# EAGLE design board (EAGLE 9.4.2)

## Sheet 1 of 2
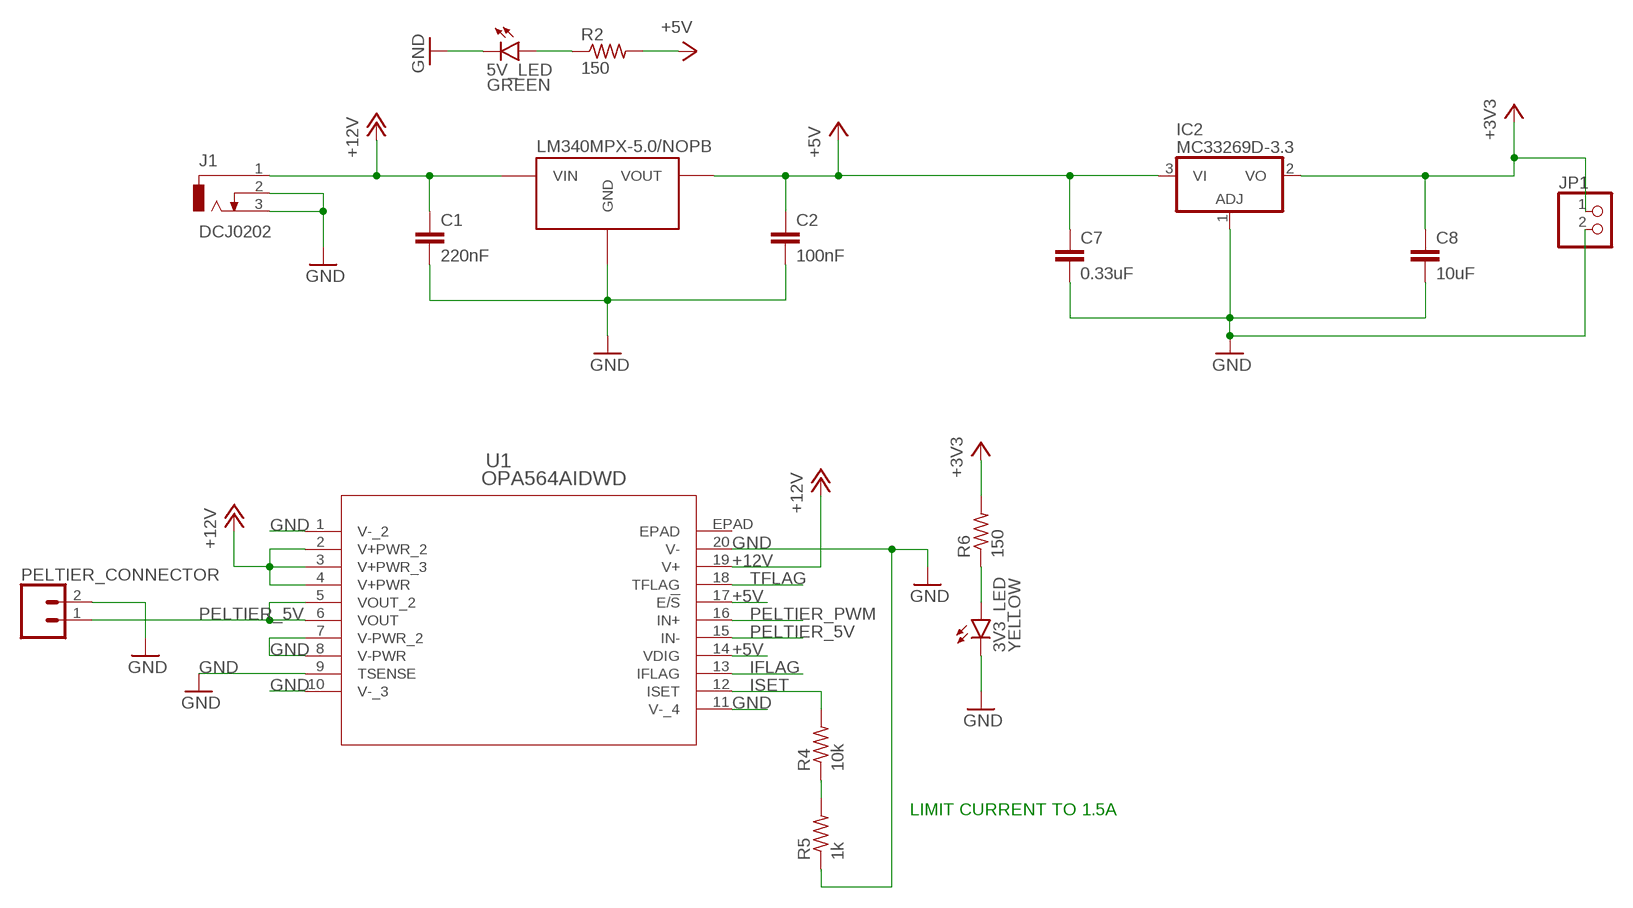
[diagram p0: schematic, sheet 1]

### Parts
3V3_LED  YELLOW  LEDCHIP-LED0603  [CHIP-LED0603]
5V_LED  GREEN  LEDCHIP-LED0603  [CHIP-LED0603]
C1  220nF  C-EUC0805  [C0805]
C2  100nF  C-EUC0805  [C0805]
C7  0.33uF  C-EUC0805  [C0805]
C8  10uF  C-EUC0805  [C0805]
IC2  MC33269D-3.3  [DPACK]
J1  DCJ0202  [DCJ0202]
JP1  PINHD-1X2  [1X02]
LDO1  LM340MPX-5.0/NOPB  [SOT-223]
PELTIER_CONNECTOR  CONN_025MM  [SCREWTERMINAL-5MM-2]
R2  150  R-US_R0603  [R0603]
R4  10k  R-US_R0603  [R0603]
R5  1k  R-US_R0603  [R0603]
R6  150  R-US_R0603  [R0603]
U1  OPA564AIDWD  [DWD20_4P62X3P56]

### Nets
+3V3: C8.1 IC2.2(VO) JP1.1 R6.2
+5V: C2.1 C7.1 IC2.3(VI) LDO1.P$3(VOUT) R2.2 U1.14(VDIG) U1.17(E/!S) ; also sheet 2
+12V: C1.1 J1.1 LDO1.P$1(VIN) U1.2(V+PWR_2) U1.3(V+PWR_3) U1.4(V+PWR) U1.19(V+) ; also sheet 2
GND: 3V3_LED.C 5V_LED.C C1.2 C2.2 C7.2 C8.2 IC2.1(ADJ) J1.2 J1.3 JP1.2 LDO1.P$2(GND) LDO1.P$4(GND) PELTIER_CONNECTOR.2 R5.1 U1.1(V-_2) U1.7(V-PWR_2) U1.8(V-PWR) U1.9(TSENSE) U1.10(V-_3) U1.11(V-_4) U1.20(V-) ; also sheet 2
IFLAG: U1.13(IFLAG) ; also sheet 2
ISET: R4.2 U1.12(ISET)
N$5: 5V_LED.A R2.1
N$21: R4.1 R5.2
N$37: 3V3_LED.A R6.1
PELTIER_5V: PELTIER_CONNECTOR.1 U1.5(VOUT_2) U1.6(VOUT) U1.15(IN-)
PELTIER_PWM: U1.16(IN+) ; also sheet 2
TFLAG: U1.18(TFLAG) ; also sheet 2
Unconnected: U1.EPAD

### Notes on the sheet
- LIMIT CURRENT TO 1.5A

## Sheet 2 of 2
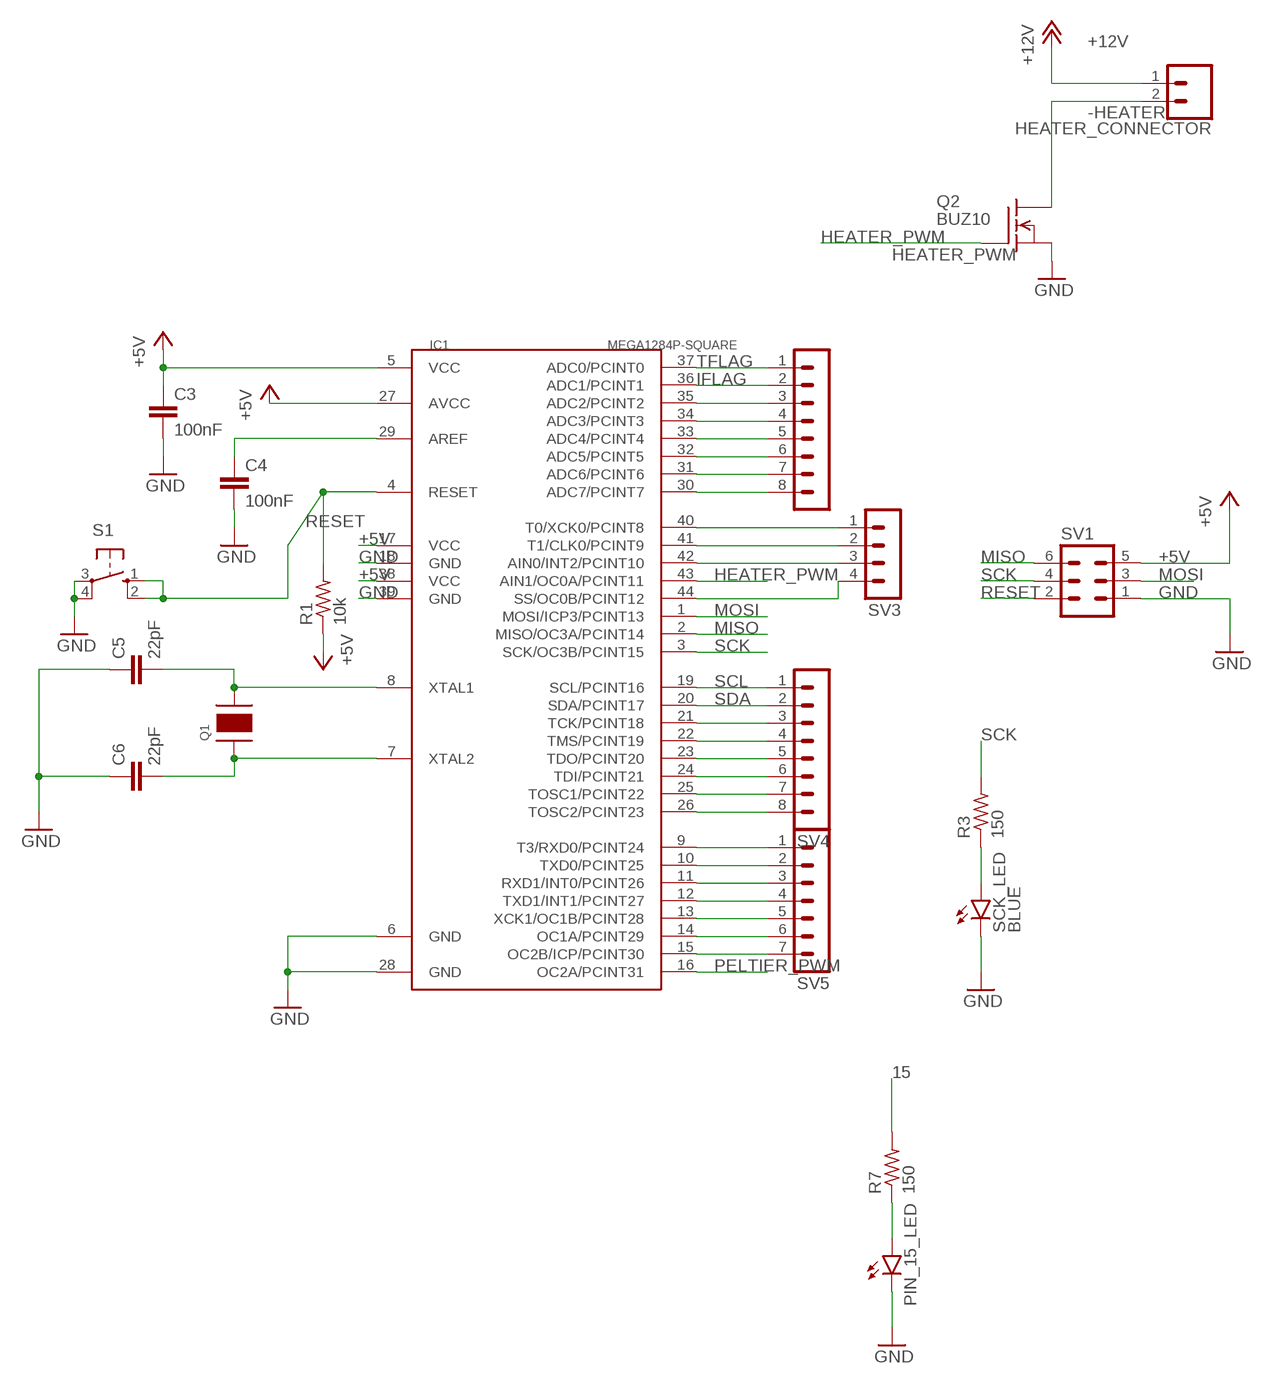
[diagram p1: schematic, sheet 2]

### Parts
C3  100nF  C-EUC0603  [C0603]
C4  100nF  C-EUC0603  [C0603]
C5  22pF  C-EUC0603  [C0603]
C6  22pF  C-EUC0603  [C0603]
HEATER_CONNECTOR  CONN_025MM  [SCREWTERMINAL-5MM-2]
IC1  MEGA1284P-SQUARE  [TQFP44]
PIN_15_LED  BLUE  LEDCHIP-LED0603  [CHIP-LED0603]
Q1  CRYSTAL_16MHZ_SMD  [4-SMD_DFN]
Q2  BUZ10  [TO220]
R1  10k  R-US_R0603  [R0603]
R3  150  R-US_R0603  [R0603]
R7  150  R-US_R0603  [R0603]
S1  10-XX  [B3F-10XX]
SCK_LED  BLUE  LEDCHIP-LED0603  [CHIP-LED0603]
SV1  MA03-2  [MA03-2]
SV2  MA08-1  [MA08-1]
SV3  MA04-1  [MA04-1]
SV4  MA08-1  [MA08-1]
SV5  MA07-1  [MA07-1]

### Nets
9: IC1.9(T3/RXD0/PCINT24) SV5.1
10: IC1.10(TXD0/PCINT25) SV5.2
11: IC1.11(RXD1/INT0/PCINT26) SV5.3
12: IC1.12(TXD1/INT1/PCINT27) SV5.4
13: IC1.13(XCK1/OC1B/PCINT28) SV5.5
14: IC1.14(OC1A/PCINT29) SV5.6
15: IC1.15(OC2B/ICP/PCINT30) R7.2 SV5.7
21: IC1.21(TCK/PCINT18) SV4.3
22: IC1.22(TMS/PCINT19) SV4.4
23: IC1.23(TDO/PCINT20) SV4.5
24: IC1.24(TDI/PCINT21) SV4.6
25: IC1.25(TOSC1/PCINT22) SV4.7
26: IC1.26(TOSC2/PCINT23) SV4.8
30: IC1.30(ADC7/PCINT7) SV2.8
31: IC1.31(ADC6/PCINT6) SV2.7
32: IC1.32(ADC5/PCINT5) SV2.6
33: IC1.33(ADC4/PCINT4) SV2.5
34: IC1.34(ADC3/PCINT3) SV2.4
35: IC1.35(ADC2/PCINT2) SV2.3
40: IC1.40(T0/XCK0/PCINT8) SV3.1
41: IC1.41(T1/CLK0/PCINT9) SV3.2
42: IC1.42(AIN0/INT2/PCINT10) SV3.3
44: IC1.44(SS/OC0B/PCINT12) SV3.4
+5V: C3.1 IC1.5(VCC) IC1.17(VCC) IC1.27(AVCC) IC1.38(VCC) R1.1 SV1.5 ; also sheet 1
+12V: HEATER_CONNECTOR.1 ; also sheet 1
-HEATER: HEATER_CONNECTOR.2 Q2.2(D)
GND: C3.2 C4.2 C5.1 C6.1 IC1.6(GND) IC1.18(GND) IC1.28(GND) IC1.39(GND) PIN_15_LED.C Q2.3(S) S1.3(P) S1.4(P1) SCK_LED.C SV1.1 ; also sheet 1
HEATER_PWM: IC1.43(AIN1/OC0A/PCINT11) Q2.1(G)
IFLAG: IC1.36(ADC1/PCINT1) SV2.2 ; also sheet 1
MISO: IC1.2(MISO/OC3A/PCINT14) SV1.6
MOSI: IC1.1(MOSI/ICP3/PCINT13) SV1.3
N$1: PIN_15_LED.A R7.1
N$2: C4.1 IC1.29(AREF)
N$3: C5.2 IC1.8(XTAL1) Q1.X2
N$4: C6.2 IC1.7(XTAL2) Q1.X1
N$6: R3.1 SCK_LED.A
PELTIER_PWM: IC1.16(OC2A/PCINT31) ; also sheet 1
RESET: IC1.4(RESET) R1.2 S1.1(S) S1.2(S1) SV1.2
SCK: IC1.3(SCK/OC3B/PCINT15) R3.2 SV1.4
SCL: IC1.19(SCL/PCINT16) SV4.1
SDA: IC1.20(SDA/PCINT17) SV4.2
TFLAG: IC1.37(ADC0/PCINT0) SV2.1 ; also sheet 1

## Library data of the parts
3V3_LED 5V_LED PIN_15_LED SCK_LED = led:LED: LED OSRAM: - CHIPLED LG R971, LG N971, LY N971, LG Q971, LY Q971, LO R971, LY R971 LH N974, LH R974 LS Q976, LO Q976, LY Q976 LO Q996 - Hyper CHIPLED LW Q18S LB Q993, LB Q99A, LB R99A - SideLED LS A670, LO A670, LY A670, LG A670, LP A670 LB A673, LV A673, LT A673, LW A673 LH A674 LY A675 LS A676, LA A676, LO A676, LY A676, LW A676 LS A679, LY A679, LG A679 - Hyper Micro SIDELED® LS Y876, LA Y876, LO Y876, LY Y876 LT Y87S - SmartLED LW L88C, LW L88S LB L89C, LB L89S, LG L890 LS L89K, LO L89K, LY L89K LS L896, LA L896, LO L896, LY L896 - TOPLED LS T670, LO T670, LY T670, LG T670, LP T670 LSG T670, LSP T670, LSY T670, LOP T670, LYG T670 LG T671, LOG T671, LSG T671 LB T673, LV T673, LT T673, LW T673 LH T674 LS T676, LA T676, LO T676, LY T676, LB T676, LH T676, LSB T676, LW T676 LB T67C, LV T67C, LT T67C, LS T67K, LO T67K, LY T67K, LW E67C LS E67B, LA E67B, LO E67B, LY E67B, LB E67C, LV E67C, LT E67C LW T67C LS T679, LY T679, LG T679 LS T770, LO T770, LY T770, LG T770, LP T770 LB T773, LV T773, LT T773, LW T773 LH T774 LS E675, LA E675, LY E675, LS T675 LS T776, LA T776, LO T776, LY T776, LB T776 LHGB T686 LT T68C, LB T68C - Hyper Mini TOPLED® LB M676 - Mini TOPLED Santana® LG M470 LS M47K, LO M47K, LY M47K Source: http://www.osram.convergy.de LUXEON: - LUMILED® LXK2-PW12-R00, LXK2-PW12-S00, LXK2-PW14-U00, LXK2-PW14-V00 LXK2-PM12-R00, LXK2-PM12-S00, LXK2-PM14-U00 LXK2-PE12-Q00, LXK2-PE12-R00, LXK2-PE12-S00, LXK2-PE14-T00, LXK2-PE14-U00 LXK2-PB12-K00, LXK2-PB12-L00, LXK2-PB12-M00, LXK2-PB14-N00, LXK2-PB14-P00, LXK2-PB14-Q00 LXK2-PR12-L00, LXK2-PR12-M00, LXK2-PR14-Q00, LXK2-PR14-R00 LXK2-PD12-Q00, LXK2-PD12-R00, LXK2-PD12-S00 LXK2-PH12-R00, LXK2-PH12-S00 LXK2-PL12-P00, LXK2-PL12-Q00, LXK2-PL12-R00 Source: www.luxeon.com KINGBRIGHT: KA-3528ASYC Source: www.kingbright.com
C1-C8 = rcl:C-EU: CAPACITOR, European symbol; SPICEPREFIX: C
HEATER_CONNECTOR PELTIER_CONNECTOR = SparkFun-Connectors:CONN_02: Multi connection point. Often used as Generic Header-pin footprint for 0.1 inch spaced/style header connections On any of the 0.1 inch spaced packages, you can populate with these: Break Away Headers - Straight <https://www.sparkfun.com/products/116> (PRT-00116) Break Away Male Headers - Right Angle <https://www.sparkfun.com/products/553> (PRT-00553) Female Headers <https://www.sparkfun.com/products/115> (PRT-00115) Break Away Headers - Machine Pin <https://www.sparkfun.com/products/117> (PRT-00117) Break Away Female Headers - Swiss Machine Pin <https://www.sparkfun.com/products/743> (PRT-00743) For SCREWTERMINALS and SPRING TERMINALS visit here: Screw Terimnals on SparkFun.com <https://www.sparkfun.com/search/results?term=Screw+Terminals> (5mm/3.5mm/2.54mm spacing) This device is also useful as a general connection point to wire up your design to another part of your project. Our various solder wires solder well into these plated through hole pads. Hook-Up Wire - Assortment (Stranded, 22 AWG) <https://www.sparkfun.com/products/11375> (PRT-11375) Hook-Up Wire - Assortment (Solid Core, 22 AWG) <https://www.sparkfun.com/products/11367> (PRT-11367) View the entire wire category on our website here <https://www.sparkfun.com/categories/141> Special notes: Molex polarized connector foot print use with: PRT-08233 with associated crimp pins and housings. 2.54_SCREWTERM for use with PRT-10571. 3.5mm Screw Terminal footprints for PRT-08084 5mm Screw Terminal footprints for use with PRT-08432; SF_SKU: PRT-08432
IC1 = 1284p:MEGA1284P-SQUARE
IC2 = linear:MC33269?*: Adjustable Output Low Dropout Voltage Regulator 800 mA Source: http://www.onsemi.com/pub/Collateral/MC33269-D.PDF
J1 = con-jack:DCJ0202: DC POWER JACK Source: DCJ0202.pdf; OC_FARNELL: unknown; OC_NEWARK: unknown
JP1 = pinhead:PINHD-1X2: PIN HEADER
LDO1 = MESH:LM340MPX-5.0/NOPB
Q1 = MESH:CRYSTAL_16MHZ; DIGIKEY#: XC1137CT-ND
Q2 = transistor-fet:BUZ10: N-Channel Enhancement MOSFET 50V; 20A; 0,080Ohm
R1-R7 = rcl:R-US_: RESISTOR, American symbol; SPICEPREFIX: R
S1 = switch-omron:10-XX: OMRON SWITCH; MPN: B3F-1000; OC_FARNELL: 176432; OC_NEWARK: 36M3542
SV1 = con-lstb:MA03-2: PIN HEADER; OC_FARNELL: unknown; OC_NEWARK: unknown
SV2 SV4 = con-lstb:MA08-1: PIN HEADER; OC_FARNELL: unknown; OC_NEWARK: unknown
SV3 = con-lstb:MA04-1: PIN HEADER; OC_FARNELL: unknown; OC_NEWARK: unknown
SV5 = con-lstb:MA07-1: PIN HEADER; OC_FARNELL: unknown; OC_NEWARK: unknown
U1 = op-amp-library:OPA564AIDWD; MANUFACTURER_PART_NUMBER: OPA564AIDWD; VENDOR: Texas Instruments

## Board
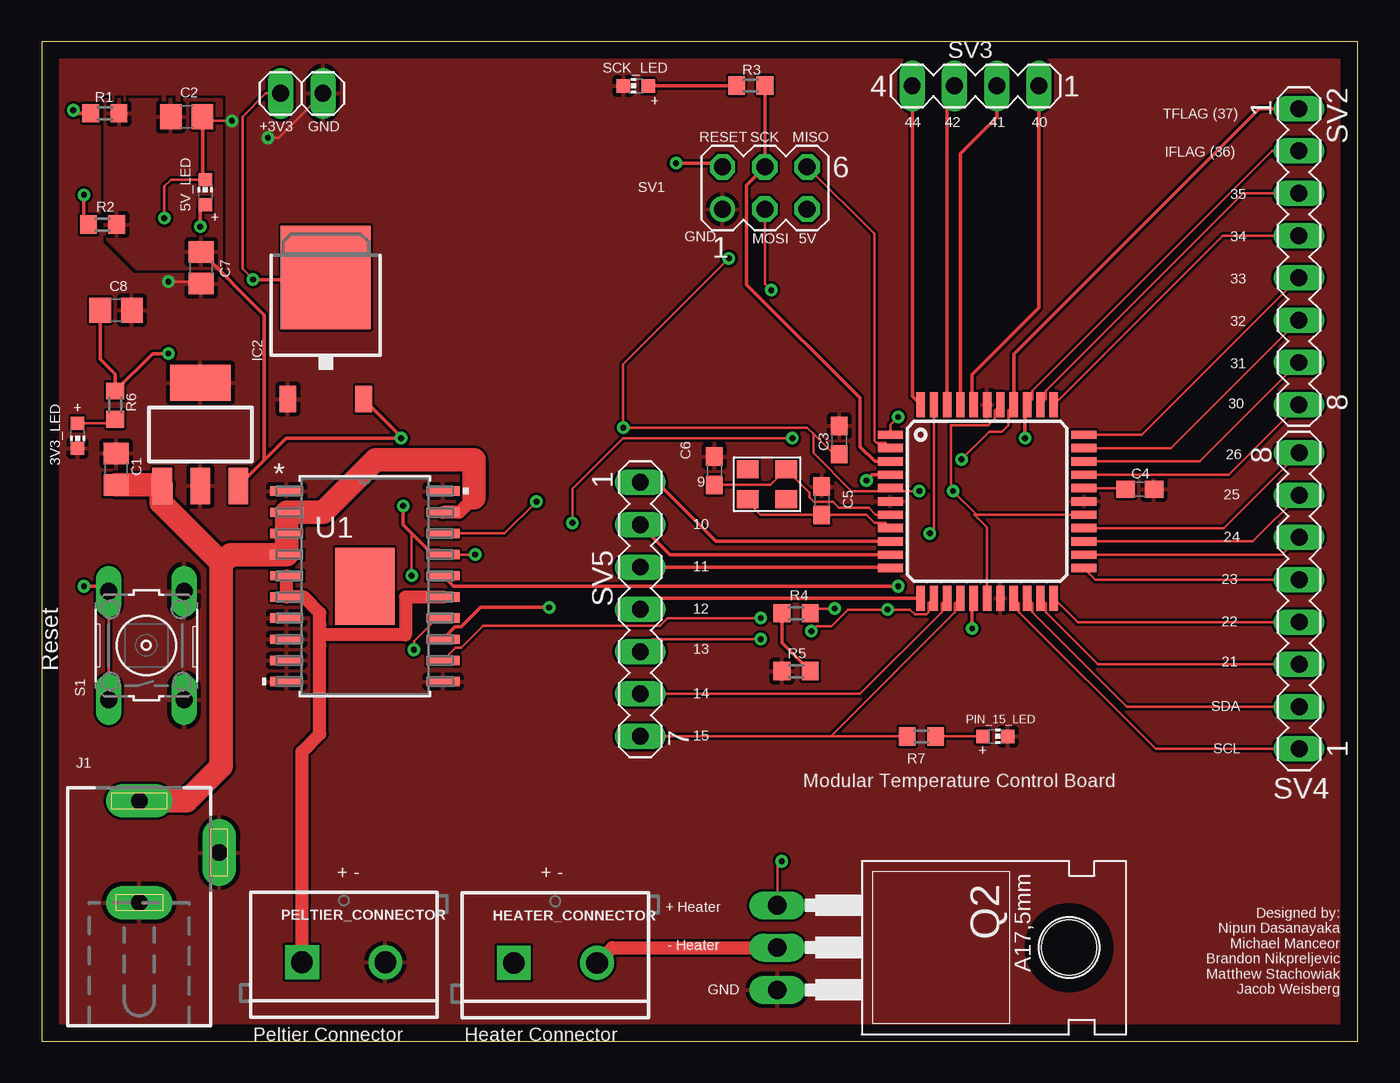
[diagram p2: board, top side]
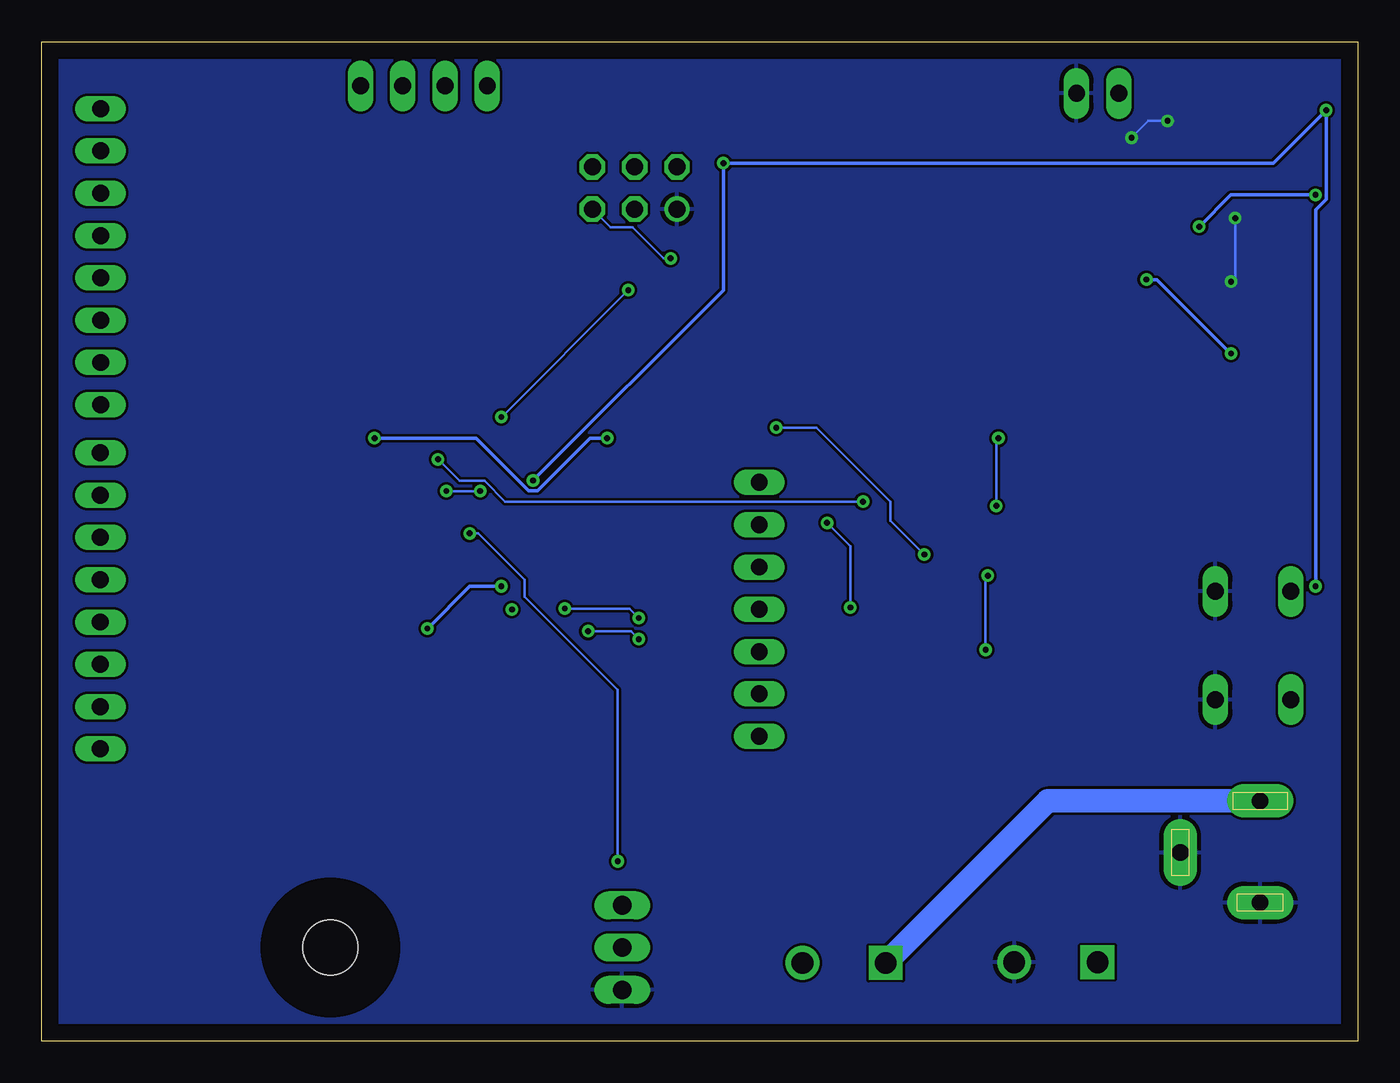
[diagram p3: board, bottom side, seen from below]

Size 79.05 x 60 mm. Coordinates in mm from the lower left corner, seen from the top.
Outline: 0,0 79.05,0 79.05,60 0,60 0,0
Copper layers (1*16): Top 0.035mm / dielectric 1.5mm / Bottom 0.035mm
Design rules "default": minimum track width 6mil, minimum drill 0.35mm, track to track 6mil, track to pad 6mil, pad to pad 6mil, via to via 6mil, smd to smd 6mil, copper to edge 40mil, drill to drill 6mil, minimum pad ring 10mil, minimum via ring 8mil, stop-mask expansion 4mil, vias tented up to drill 0mil, thermal gap 10mil

### Footprints (pad centres in the part's own frame; a part is rotated, then mirrored left to right if it is on the bottom)
CHIP-LED0603 = smd 0.8 x 0.8: A 0,-0.75; C 0,0.75
C0805 = smd 1.3 x 1.5: 1 -0.95,0; 2 0.95,0
C0603 = smd 1.1 x 1: 1 -0.85,0; 2 0.85,0
SCREWTERMINAL-5MM-2 = drill 1.3 pad 2.032 square: 1 0,0 | drill 1.3 pad 2.032: 2 5,0
TQFP44 = smd 1.5 x 0.5: 1 -5.8,4; 2 -5.8,3.2; 3 -5.8,2.4; 4 -5.8,1.6; 5 -5.8,0.8; 6 -5.8,0; 7 -5.8,-0.8; 8 -5.8,-1.6; 9 -5.8,-2.4; 10 -5.8,-3.2; 11 -5.8,-4; 23 5.8,-4; 24 5.8,-3.2; 25 5.8,-2.4; 26 5.8,-1.6; 27 5.8,-0.8; 28 5.8,0; 29 5.8,0.8; 30 5.8,1.6; 31 5.8,2.4; 32 5.8,3.2; 33 5.8,4 | smd 0.5 x 1.5: 12 -4,-5.8; 13 -3.2,-5.8; 14 -2.4,-5.8; 15 -1.6,-5.8; 16 -0.8,-5.8; 17 0,-5.8; 18 0.8,-5.8; 19 1.6,-5.8; 20 2.4,-5.8; 21 3.2,-5.8; 22 4,-5.8; 34 4,5.8; 35 3.2,5.8; 36 2.4,5.8; 37 1.6,5.8; 38 0.8,5.8; 39 0,5.8; 40 -0.8,5.8; 41 -1.6,5.8; 42 -2.4,5.8; 43 -3.2,5.8; 44 -4,5.8
DPACK = smd 1 x 1.6: 1 -2.28,-4.8; 3 2.28,-4.8 | smd 5.4 x 6.2: 2 0,2.5
DCJ0202 = drill 1 pad 2 long: 1 0,3.1; 2 4.8,0; 3 0,-3
1X02 = drill 1.016 long: 1 -1.27,0; 2 1.27,0
SOT-223 = smd 1.194 x 2.184: P$1 -2.286,0; P$2 0,0; P$3 2.286,0 | smd 3.607 x 2.184: P$4 0,6.198
4-SMD_DFN = smd 1.3 x 1.1: GND1 1.15,-0.9; GND2 -1.15,0.9; X1 -1.15,-0.9; X2 1.15,0.9
TO220 = drill 1.118 long: 1 -2.54,-6.35; 2 0,-6.35; 3 2.54,-6.35 | hole 3.302: 0,11.176
R0603 = smd 1 x 1.1: 1 -0.85,0; 2 0.85,0
B3F-10XX = drill 1.016 long: 1 -3.251,2.261; 2 3.251,2.261; 3 -3.251,-2.261; 4 3.251,-2.261
MA03-2 = drill 1.016: 1 -2.54,-1.27 | drill 1.016 octagon: 2 -2.54,1.27; 3 0,-1.27; 4 0,1.27; 5 2.54,-1.27; 6 2.54,1.27
MA08-1 = drill 1.016 long: 1 -8.89,0; 2 -6.35,0; 3 -3.81,0; 4 -1.27,0; 5 1.27,0; 6 3.81,0; 7 6.35,0; 8 8.89,0
MA04-1 = drill 1.016 long: 1 -3.81,0; 2 -1.27,0; 3 1.27,0; 4 3.81,0
MA07-1 = drill 1.016 long: 1 -7.62,0; 2 -5.08,0; 3 -2.54,0; 4 0,0; 5 2.54,0; 6 5.08,0; 7 7.62,0
DWD20_4P62X3P56 = smd 1.981 x 0.559: 1 -4.686,5.715; 2 -4.686,4.445; 3 -4.686,3.175; 4 -4.686,1.905; 5 -4.686,0.635; 6 -4.686,-0.635; 7 -4.686,-1.905; 8 -4.686,-3.175; 9 -4.686,-4.445; 10 -4.686,-5.715; 11 4.686,-5.715; 12 4.686,-4.445; 13 4.686,-3.175; 14 4.686,-1.905; 15 4.686,-0.635; 16 4.686,0.635; 17 4.686,1.905; 18 4.686,3.175; 19 4.686,4.445; 20 4.686,5.715 | smd 3.56 x 4.62: EPAD 0,0

### Placement (x,y rotation side)
3V3_LED  2.15,36.34 180 top
5V_LED  9.84,50.96 0 top
C1  4.47,34.34 90 top
C2  8.71,55.5 0 top
C3  47.9,36.08 90 top
C4  65.95,33.13 0 top
C5  46.85,32.44 270 top
C6  40.4,34.24 270 top
C7  9.57,46.43 270 top
C8  4.46,43.88 0 top
HEATER_CONNECTOR  28.36,4.7 0 top
IC1  56.78,32.4 0 top
IC2  17.06,43.34 0 top
J1  5.87,11.32 0 top
JP1  15.62,56.9 0 top
LDO1  9.54,33.33 0 top
PELTIER_CONNECTOR  15.64,4.74 0 top
PIN_15_LED  57.28,18.29 270 top
Q1  43.56,33.43 180 top
Q2  50.52,5.62 270 top
R1  3.8,55.7 180 top
R2  3.66,49.02 0 top
R3  42.59,57.37 0 top
R4  45.31,25.69 0 top
R5  45.31,22.21 0 top
R6  4.42,38.18 90 top
R7  52.83,18.29 180 top
S1  6.29,23.75 90 top
SCK_LED  35.69,57.34 90 top
SV1  43.43,51.22 0 top
SV2  75.5,47.09 270 top
SV3  56.09,57.34 180 top
SV4  75.52,26.43 90 top
SV5  35.95,25.92 270 top
U1  19.41,27.3 0 top

### Tracks (layer width: path | path; a pad name or v marks a point on that pad's centre or on a via)
9
  Top 0.2: IC1.9 40.48,30 36.95,33.54 SV5.1
10
  Top 0.2: IC1.10 37.75,29.2 SV5.2
11
  Top 0.2: SV5.3 50.92,28.46 IC1.11
12
  Top 0.2: IC1.12 36.63,26.6 SV5.4
13  (via drill 0.35)
  Top 0.152: SV5.5 36.7,24.13 v43.18,24.13 | v46.23,24.61 46.53,24.91 47.42,24.91 48.42,25.91 v50.8,25.91 52.15,25.91 52.44,25.62 53.12,25.62 53.26,25.75 53.26,26.28 IC1.13
  Bottom 0.152: v43.18,24.13 43.66,24.61 v46.23,24.61
14
  Top 0.152: IC1.14 54.06,26.28 54.06,25.75 49.14,20.84 SV5.6
15
  Top 0.152: IC1.15 54.86,26.28 54.86,25.75 47.4,18.3 | SV5.7 47.4,18.3 | 47.4,18.3 R7.2
21
  Top 0.152: IC1.21 60.3,26.28 60.3,25.75 63.44,22.62 SV4.3
22
  Top 0.152: SV4.4 62.22,25.16 IC1.22
23
  Top 0.152: SV4.5 63.28,27.7 IC1.23
24
  Top 0.152: SV4.6 74.47,29.2 IC1.24
25
  Top 0.152: SV4.7 72.73,30 IC1.25
26
  Top 0.152: SV4.8 71,30.8 IC1.26
30
  Top 0.152: SV2.8 71.31,34 IC1.30
31
  Top 0.152: SV2.7 69.56,34.8 IC1.31
32
  Top 0.152: SV2.6 67.83,35.6 IC1.32
33
  Top 0.152: SV2.5 66.08,36.4 IC1.33
34
  Top 0.152: SV2.4 70.94,48.36 IC1.34
35
  Top 0.152: IC1.35 60.3,38.52 60.3,39.05 72.16,50.9 SV2.3
40
  Top 0.2: SV3.1 59.9,44.02 55.88,40.01 55.88,38.3 IC1.40
41
  Top 0.2: IC1.41 55.18,53.27 57.36,55.45 SV3.2
42
  Top 0.2: IC1.42 54.38,56.91 SV3.3
44
  Top 0.2: IC1.44 52.28,38.7 SV3.4
+3V3  (via drill 0.35)
  Top 0.152: v12.7,45.72 12.06,46.35 12.06,54.48 12.06,54.61 12.06,55.5 13.46,56.9 JP1.1
  Top 0.2: C8.1 3.52,40.94 4.42,40.03 R6.2 6.66,41.27 v7.62,41.27 | IC2.2 16.94,45.72 v12.7,45.72
  Bottom 0.2: v12.7,45.72 12.06,45.72 v7.62,41.27
+5V  (via drill 0.35)
  Top 0.152: 22.23,30.48 v22.23,27.94 | U1.14 23.75,25.39 22.35,24 v22.35,23.49 | IC1.27 56.16,31.6 | 56.16,31.6 56.03,31.6 56.78,30.85 IC1.17 | 56.16,31.6 v54.74,33.02 54.61,33.15 54.61,36.97 56.87,36.97 57.26,37.35 57.26,37.88 IC1.38 | v52.7,33.02 51.16,33.02 IC1.5 50.8,33.02 48.64,33.02 46.35,35.31 46.35,36.45 | v41.27,46.99 34.92,40.64 v34.92,36.83 45.97,36.83 46.35,36.45 | 46.35,36.45 47.58,35.23 | U1.17 v26.03,29.2 v26.04,29.21
  Top 0.2: IC2.3 21.59,36.29 v21.59,36.2 14.69,36.2 13.38,34.88 | v21.72,32.13 21.72,30.99 22.23,30.48 23.25,29.46 23.85,29.46 U1.17 | LDO1.P$3 13.38,34.88 | C7.1 13.38,43.58 13.38,34.88 | 47.58,35.23 C3.1
  Bottom 0.152: v22.23,27.94 22.35,27.81 v22.35,23.49 | v54.74,33.02 v52.7,33.02 | v34.92,36.83 32.51,36.83 28.07,32.38 28.07,31.24 v26.04,29.21 | SV1.5 44.89,48.87 43.56,48.87 41.69,46.99 v41.27,46.99 | v21.59,36.2 21.72,36.07 v21.72,32.13
  pour Top: 5.71,46.35 10.79,46.35 10.79,56.52 3.81,56.52 3.81,48.26
+12V
  Top 0.152: 7.19,33.38 LDO1.P$1
  Top 0.356: U1.4 U1.3 U1.2
  Top 0.787: 25.96,32.63 25.07,31.75 U1.19
  Top 1.422: 10.79,28.64 10.79,16.51 8.71,14.42 J1.1 | C1.1 7.19,33.38 7.19,32.31 10.79,28.7 10.79,28.64 | 10.79,28.64 11.36,29.2 U1.4 U1.2 16.91,31.75 20.06,34.9 25.96,34.9 25.96,32.63
  Bottom 1.422: J1.1 18.63,14.42 HEATER_CONNECTOR.1
-HEATER
  Top 0.787: HEATER_CONNECTOR.2 34.27,5.62 Q2.2
GND  (via drill 0.35)
  Top 0.152: 5V_LED.C 7.77,51.71 7.37,51.31 v7.37,49.4 | v7.62,45.59 9.46,45.59 C7.2 | C2.2 9.91,55.24 v11.43,55.24 | v13.59,54.23 14.22,54.23 JP1.2
  Top 0.2: C2.2 9.66,51.88 5V_LED.C
  Bottom 0.152: v7.37,49.4 7.37,45.85 v7.62,45.59 | v11.43,55.24 12.57,55.24 v13.59,54.23
  pour Top (rank 2): -1.91,60.96 80.64,60.96 80.64,-1.27 -1.91,-1.27
  pour Bottom (rank 2): -1.91,60.96 80.64,60.96 80.64,-1.27 -1.91,-1.27
HEATER_PWM  (via drill 0.35)
  Top 0.152: Q2.1 44.17,10.52 v44.45,10.79 | v53.34,30.48 53.58,30.72 IC1.43
  Bottom 0.152: v44.45,10.79 44.45,21.08 50.04,26.67 50.04,27.69 52.83,30.48 v53.34,30.48
IFLAG  (via drill 0.35)
  Top 0.152: IC1.36 59.5,38.52 59.5,39.05 73.9,53.44 SV2.2 | v31.88,31.11 31.88,33.15 34.92,36.2 v45.09,36.2
  Top 0.2: U1.13 24.84,24.86 25.2,24.86 26.37,26.04 v30.48,26.04 | v59.05,36.2 59.05,38.08 IC1.36
  Bottom 0.152: v30.48,26.04 30.48,29.72 v31.88,31.11
  Bottom 0.2: v45.09,36.2 46.1,36.2 49.27,33.02 49.79,33.02 52.96,36.2 v59.05,36.2
ISET  (via drill 0.35)
  Top 0.152: U1.12 24.86,23.62 25.19,23.62 26.5,24.93 37.12,24.93 37.59,25.4 v43.18,25.4 | v47.62,25.97 46.44,25.97 R4.2
  Bottom 0.152: v43.18,25.4 43.75,25.97 v47.62,25.97
MISO
  Top 0.152: IC1.2 50.66,35.92 50.13,35.92 50,36.05 50,48.45 SV1.6
MOSI  (via drill 0.35)
  Top 0.152: IC1.1 50.98,37.01 v51.44,37.47 | SV1.3 43.43,45.47 v43.81,45.09
  Bottom 0.152: v51.44,37.47 v43.81,45.09
N$1
  Top 0.152: R7.1 PIN_15_LED.A
N$2
  Top 0.152: IC1.29 65.03,33.2 C4.1
N$3
  Top 0.152: Q1.X2 42.41,32.34 43.16,31.59 C5.2 49.54,31.59 50.01,31.12 50.66,31.12 IC1.8
N$4
  Top 0.152: C6.2 43.77,33.39 Q1.X1 46.12,32.92 46.12,32.64 46.4,32.37 47.52,32.37 47.88,32 49.15,32 | IC1.7 50.09,31.6 49.68,32 49.15,32 | 49.15,32 | 49.15,32
N$5  (via drill 0.35)
  Top 0.2: R2.1 2.54,49.28 v2.54,50.8 | v9.53,48.9 9.53,49.9 5V_LED.A
  Bottom 0.2: v2.54,50.8 7.62,50.8 v9.53,48.9
N$6
  Top 0.2: SCK_LED.A 41.71,57.34 R3.1
N$21
  Top 0.2: R5.2 44.46,23.91 R4.1
N$37
  Top 0.152: 3V3_LED.A 4.17,37.09 R6.1
PELTIER_5V
  Top 0.787: PELTIER_CONNECTOR.1 15.64,17.38 16.71,18.45 16.71,23.75 16.71,24.38 | U1.15 21.84,26.67 21.84,24.38 16.71,24.38 | 16.71,24.38 16.71,25.02 16.71,25.7 15.74,26.66 U1.6 U1.5
PELTIER_PWM  (via drill 0.35)
  Top 0.2: U1.16 24.73,27.3 v51.44,27.3 | v55.88,24.77 55.88,26.5 IC1.16
  Bottom 0.2: v51.44,27.3 53.34,27.3 v55.88,24.77
RESET  (via drill 0.35)
  Top 0.152: S1.2 S1.1
  Top 0.2: R1.2 2.08,55.7 v1.91,55.88 | v38.1,52.7 40.67,52.7 SV1.2 | v49.53,33.66 49.88,34 IC1.4 | v2.54,27.3 3.73,27.3 S1.2
  Bottom 0.2: v49.53,33.66 38.1,45.09 v38.1,52.7 5.08,52.7 v1.91,55.88 1.91,50.54 2.54,49.91 v2.54,27.3
SCK
  Top 0.2: R3.2 SV1.4 42.34,51.39 42.34,45.42 49.15,38.61 49.15,35.69 50.04,34.8 IC1.3
SCL
  Top 0.152: IC1.19 58.7,26.28 58.7,25.75 66.92,17.54 SV4.1
SDA
  Top 0.152: IC1.20 59.5,26.28 59.5,25.75 65.18,20.08 SV4.2
TFLAG  (via drill 0.35)
  Top 0.152: IC1.37 58.06,37.88 58.06,36.97 57.67,36.59 56.91,36.59 v55.24,34.92 | v29.72,32.38 27.81,30.48 U1.18
  Top 0.2: SV2.1 73.12,55.98 58.38,41.23 IC1.37
  Bottom 0.152: v55.24,34.92 53.95,33.63 52.45,33.63 51.21,32.38 v29.72,32.38

### Text on the board
tPlace: + | +3V3 | GND | 44 | 42 | 41 | 40 | TFLAG (37) | RESET | SCK | MISO | IFLAG (36) | 35 | + | GND | MOSI | 5V | 34 | 33 | 32 | 31 | + | 30 | 26 | 9 | 25 | 10 | 24 | 11 | 23 | Reset | 12 | 22 | 13 | 21 | 14 | SDA | 15 | + | SCL | Modular Temperature Control Board | + - | + - | + Heater | Designed by: / Nipun Dasanayaka / Michael Manceor / Brandon Nikpreljevic / Matthew Stachowiak / Jacob Weisberg | - Heater | GND | Peltier Connector | Heater Connector